# EAGLE schematic pizzaLCD (EAGLE 6.1)
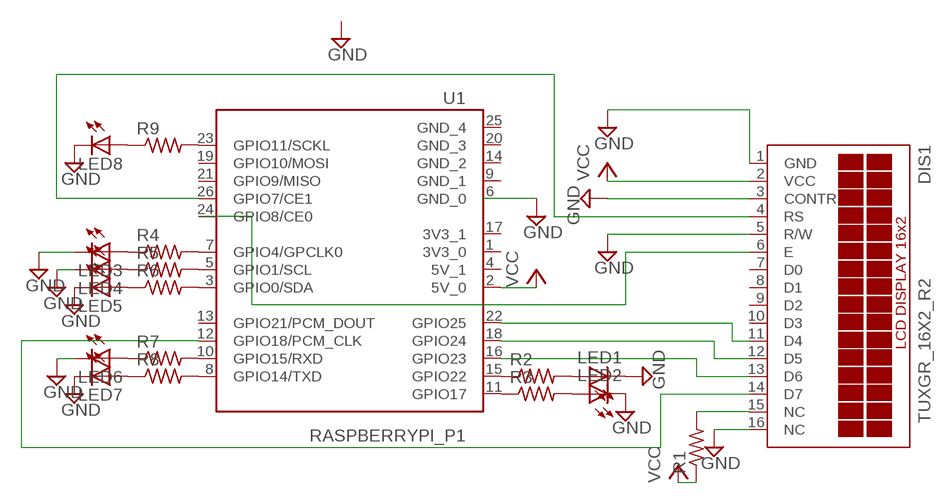
[diagram p0: schematic, sheet 1]

## Parts
DIS1  TUXGR_16X2_R2  [TUXGR_16X2_R2]
LED1  LED3MM  [LED3MM]
LED2  LED3MM  [LED3MM]
LED3  LED3MM  [LED3MM]
LED4  LED3MM  [LED3MM]
LED5  LED3MM  [LED3MM]
LED6  LED3MM  [LED3MM]
LED7  LED3MM  [LED3MM]
LED8  LED3MM  [LED3MM]
R1  R  [250-80]
R2  R/5  [0204/5]
R3  R/5  [0204/5]
R4  R/5  [0204/5]
R5  R/5  [0204/5]
R6  R/5  [0204/5]
R7  R/5  [0204/5]
R8  R/5  [0204/5]
R9  R/5  [0204/5]
U1  RASPBERRYPI_P1  [2X13]

## Nets
GND: DIS1.1(GND) DIS1.3(CONTR) DIS1.5(R/W) DIS1.16(NC) LED1.K(C) LED2.K(C) LED3.K(C) LED4.K(C) LED5.K(C) LED6.K(C) LED7.K(C) LED8.K(C)
N$1: DIS1.4(RS) U1.26(GPIO7/CE1)
N$2: DIS1.6(E) U1.24(GPIO8/CE0)
N$3: R2.1 U1.15(GPIO22)
N$4: DIS1.12(D5) U1.18(GPIO24)
N$5: DIS1.13(D6) U1.16(GPIO23)
N$6: DIS1.11(D4) U1.22(GPIO25)
N$8: LED1.A R2.2
N$9: DIS1.15(NC) R1.P$2
N$10: R3.1 U1.11(GPIO17)
N$11: LED2.A R3.2
N$12: R4.2 U1.7(GPIO4/GPCLK0)
N$13: R5.2 U1.5(GPIO1/SCL)
N$14: R6.2 U1.3(GPIO0/SDA)
N$15: R7.2 U1.10(GPIO15/RXD)
N$16: R8.2 U1.8(GPIO14/TXD)
N$17: R9.2 U1.23(GPIO11/SCKL)
N$18: LED4.A R5.1
N$19: LED3.A R4.1
N$20: LED5.A R6.1
N$21: LED6.A R7.1
N$22: LED7.A R8.1
N$23: LED8.A R9.1
N$24: DIS1.14(D7) U1.12(GPIO18/PCM_CLK)
VCC: DIS1.2(VCC) R1.P$1 U1.2(5V_0)
Unconnected: DIS1.7(D0) DIS1.8(D1) DIS1.9(D2) DIS1.10(D3) U1.1(3V3_0) U1.4(5V_1) U1.6(GND_0) U1.9(GND_1) U1.13(GPIO21/PCM_DOUT) U1.14(GND_2) U1.17(3V3_1) U1.19(GPIO10/MOSI) U1.20(GND_3) U1.21(GPIO9/MISO) U1.25(GND_4)

## Library data of the parts
DIS1 = display-lcd:TUXGR_16X2_R2: Tuxgraphics LCD display 16x2 characters reflective, without background light Source: tuxgr_12x2_r2.pdf; OC_FARNELL: unknown; OC_NEWARK: unknown
LED1-LED8 = led:LED: LED OSRAM: - CHIPLED LG R971, LG N971, LY N971, LG Q971, LY Q971, LO R971, LY R971 LH N974, LH R974 LS Q976, LO Q976, LY Q976 LO Q996 - Hyper CHIPLED LW Q18S LB Q993, LB Q99A, LB R99A - SideLED LS A670, LO A670, LY A670, LG A670, LP A670 LB A673, LV A673, LT A673, LW A673 LH A674 LY A675 LS A676, LA A676, LO A676, LY A676, LW A676 LS A679, LY A679, LG A679 - Hyper Micro SIDELED® LS Y876, LA Y876, LO Y876, LY Y876 LT Y87S - SmartLED LW L88C, LW L88S LB L89C, LB L89S, LG L890 LS L89K, LO L89K, LY L89K LS L896, LA L896, LO L896, LY L896 - TOPLED LS T670, LO T670, LY T670, LG T670, LP T670 LSG T670, LSP T670, LSY T670, LOP T670, LYG T670 LG T671, LOG T671, LSG T671 LB T673, LV T673, LT T673, LW T673 LH T674 LS T676, LA T676, LO T676, LY T676, LB T676, LH T676, LSB T676, LW T676 LB T67C, LV T67C, LT T67C, LS T67K, LO T67K, LY T67K, LW E67C LS E67B, LA E67B, LO E67B, LY E67B, LB E67C, LV E67C, LT E67C LW T67C LS T679, LY T679, LG T679 LS T770, LO T770, LY T770, LG T770, LP T770 LB T773, LV T773, LT T773, LW T773 LH T774 LS E675, LA E675, LY E675, LS T675 LS T776, LA T776, LO T776, LY T776, LB T776 LHGB T686 LT T68C, LB T68C - Hyper Mini TOPLED® LB M676 - Mini TOPLED Santana® LG M470 LS M47K, LO M47K, LY M47K Source: http://www.osram.convergy.de LUXEON: - LUMILED® LXK2-PW12-R00, LXK2-PW12-S00, LXK2-PW14-U00, LXK2-PW14-V00 LXK2-PM12-R00, LXK2-PM12-S00, LXK2-PM14-U00 LXK2-PE12-Q00, LXK2-PE12-R00, LXK2-PE12-S00, LXK2-PE14-T00, LXK2-PE14-U00 LXK2-PB12-K00, LXK2-PB12-L00, LXK2-PB12-M00, LXK2-PB14-N00, LXK2-PB14-P00, LXK2-PB14-Q00 LXK2-PR12-L00, LXK2-PR12-M00, LXK2-PR14-Q00, LXK2-PR14-R00 LXK2-PD12-Q00, LXK2-PD12-R00, LXK2-PD12-S00 LXK2-PH12-R00, LXK2-PH12-S00 LXK2-PL12-P00, LXK2-PL12-Q00, LXK2-PL12-R00 Source: www.luxeon.com KINGBRIGHT: KA-3528ASYC Source: www.kingbright.com
R1-R9 = Passive_Robotech:R
U1 = Connector_Robotech:RASPBERRYPI_P1: Raspberry Pi Pin Header refered RPi low level peripherals <http://elinux.org/RPi_Low-level_peripherals>